# EAGLE design stm32f030f4p6-enc28j60 (EAGLE 7.2.0)
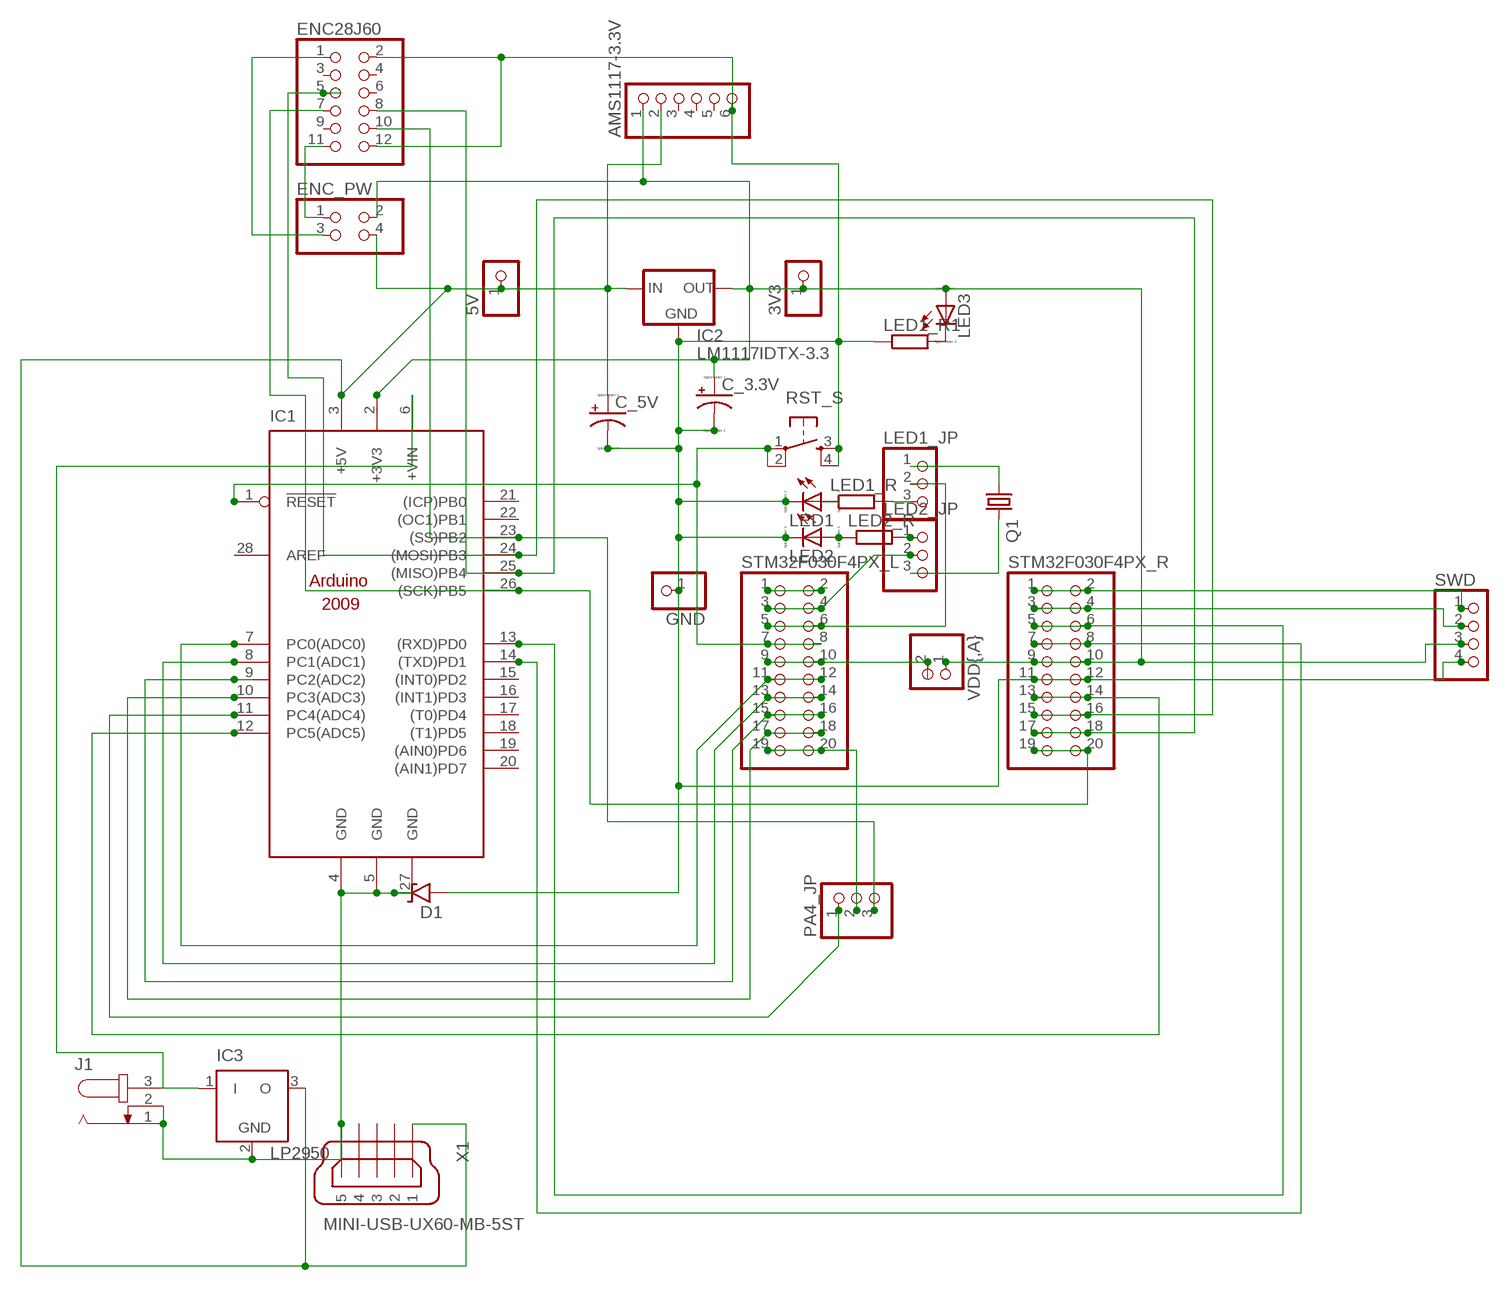
[diagram p0: schematic, sheet 1]

## Parts
3V3  PINHD-1X1_2.00  [1X01M]
5V  PINHD-1X1_2.00  [1X01M]
AMS1117-3.3V  PINHD-1X06_2.54  [1X06]
C_3.3V  CPOL-USE3.5-8  [E3,5-8]
C_5V  CPOL-USE3.5-8  [E3,5-8]
D1  1N9ZENER2  [DO35-2]
ENC28J60  PINHD-2X6_2.54  [2X06]
ENC_PW  PINHD-2X2_2.54  [2X02]
GND  PINHD-1X1_2.00  [1X01M]
IC1  ARDUINO2009_PIN_12  [ARDUINO2009_2]
IC2  LM1117IDTX-3.3  [TO252]
IC3  LP2950  [DPACK]
J1  JACK-PLUG0  [SPC4077]
LED1  LED_ELD260  [LED_LD260]
LED1_JP  PINHD-1X3_2.54  [1X03]
LED1_R  R-EU_0204/7  [0204/7]
LED1_R1  R-EU_0204/7  [0204/7]
LED2  LED_ELD260  [LED_LD260]
LED2_JP  PINHD-1X3_2.54  [1X03]
LED2_R  R-EU_0204/7  [0204/7]
LED3  LED_ELD260  [LED_LD260]
PA4_JP  PINHD-1X3_2.54  [1X03]
Q1  CRYSTALHC49S  [HC49/S]
RST_S  TAC_SWITCHPTH  [TACTILE-PTH]
STM32F030F4PX_L  PINHD-2X10  [2X10]
STM32F030F4PX_R  PINHD-2X10  [2X10]
SWD  PINHD-1X4  [1X04]
VDD{,A}  PINHD-1X2  [1X02]
X1  MINI-USB-UX60-MB-5ST  [UX60-MB-5ST]

## Nets
5V: 5V.1 AMS1117-3.3V.2 C_5V.+ ENC_PW.4 IC1.3(+5V) IC2.2(IN) IC3.3(O) X1.1
GND@0: AMS1117-3.3V.6 C_3.3V.- C_5V.- D1.A ENC28J60.2 ENC28J60.12 GND.1 IC2.1(GND) LED1.K(C) LED1_R1.1 LED2.K(C) RST_S.3 RST_S.4 STM32F030F4PX_R.11 STM32F030F4PX_R.12 SWD.4
GND_RAW: D1.C IC1.4(GND) IC1.5(GND) IC1.27(GND) IC3.2(GND) J1.1 J1.2 X1.5
N$1: STM32F030F4PX_L.9 STM32F030F4PX_L.10 VDD{,A}.2
N$3: STM32F030F4PX_L.1 STM32F030F4PX_L.2
N$4: LED2_JP.2 STM32F030F4PX_L.3 STM32F030F4PX_L.4
N$5: LED1_JP.2 STM32F030F4PX_L.5 STM32F030F4PX_L.6
N$6: PA4_JP.2 STM32F030F4PX_L.19 STM32F030F4PX_L.20
N$7: IC1.7(PC0(ADC0)) STM32F030F4PX_L.11 STM32F030F4PX_L.12
N$8: IC1.8(PC1(ADC1)) STM32F030F4PX_L.13 STM32F030F4PX_L.14
N$9: IC1.9(PC2(ADC2)) STM32F030F4PX_L.15 STM32F030F4PX_L.16
N$10: IC1.10(PC3(ADC3)) STM32F030F4PX_L.17 STM32F030F4PX_L.18
N$11: IC1.11(PC4(ADC4)) PA4_JP.1
N$12: ENC28J60.7 IC1.26((SCK)PB5) STM32F030F4PX_R.19 STM32F030F4PX_R.20
N$13: ENC28J60.8 IC1.25((MISO)PB4) STM32F030F4PX_R.17 STM32F030F4PX_R.18
N$14: LED1_JP.3 LED1_R.2
N$15: IC1.12(PC5(ADC5)) STM32F030F4PX_R.13 STM32F030F4PX_R.14
N$17: IC1.14((TXD)PD1) STM32F030F4PX_R.7 STM32F030F4PX_R.8
N$18: IC1.13((RXD)PD0) STM32F030F4PX_R.5 STM32F030F4PX_R.6
N$19: LED1_JP.1 Q1.1
N$20: LED2_JP.3 Q1.2
N$21: IC1.1(!RESET) RST_S.1 RST_S.2 STM32F030F4PX_L.7 STM32F030F4PX_L.8
N$23: ENC28J60.10 IC1.23((SS)PB2) PA4_JP.3
N$24: IC1.6(+VIN) IC3.1(I) J1.3
N$26: LED2.A LED2_R.1
N$27: LED1.A LED1_R.1
N$29: LED2_JP.1 LED2_R.2
N$187: ENC28J60.1 ENC_PW.3
N$188: ENC28J60.11 ENC_PW.1
N$190: ENC28J60.5 IC1.24((MOSI)PB3) STM32F030F4PX_R.15 STM32F030F4PX_R.16
N$242: LED1_R1.2 LED3.K(C)
SWD_CLK: STM32F030F4PX_R.1 STM32F030F4PX_R.2 SWD.1
SWD_IO: STM32F030F4PX_R.3 STM32F030F4PX_R.4 SWD.2
VDD: 3V3.1 AMS1117-3.3V.1 C_3.3V.+ ENC_PW.2 IC1.2(+3V3) IC2.TAB(OUT) LED3.A STM32F030F4PX_R.9 STM32F030F4PX_R.10 SWD.3 VDD{,A}.1
Unconnected: AMS1117-3.3V.3 AMS1117-3.3V.4 AMS1117-3.3V.5 ENC28J60.3 ENC28J60.4 ENC28J60.6 ENC28J60.9 IC1.15((INT0)PD2) IC1.16((INT1)PD3) IC1.17((T0)PD4) IC1.18((T1)PD5) IC1.19((AIN0)PD6) IC1.20((AIN1)PD7) IC1.21((ICP)PB0) IC1.22((OC1)PB1) IC1.28(AREF) X1.2 X1.3 X1.4

## Library data of the parts
3V3 5V GND = pinhead-1:PINHD-1X1: PIN HEADER
AMS1117-3.3V = pinhead-2:PINHD-1X06: PIN HEADER
C_3.3V C_5V = resistor:CPOL-US: POLARIZED CAPACITOR, American symbol
D1 = gm-diodes:1N9*ZENER: 1N9???B Zener Diode DO-35 case 1N957B - 1N992B (6.8V to 200V)
ENC28J60 = pinhead-1:PINHD-2X6: PIN HEADER
ENC_PW = pinhead-1:PINHD-2X2: PIN HEADER
IC1 = arduino:ARDUINO2009_PIN_1: The Arduino Duemilanove ("2009") is a microcontroller board based on the ATmega168 or ATmega328. - 14 digital input/output pins (of which 6 can be used as PWM outputs) - 6 analog inputs, a 16 MHz crystal oscillator - USB connection - power jack - ISP header - reset button It contains everything needed to support the microcontroller; simply connect it to a computer with a USB cable or power it with a AC-to-DC adapter or battery to get started http://arduino.cc/en/Main/ArduinoBoardDuemilanove
IC2 = lm1117:LM1117IDTX-*
IC3 = linear:LP2950: 100 mA, Low Power Low Dropout Voltage Regulator Source: http://www.onsemi.com/pub/Collateral/LP2950-D.PDF
J1 = tango:JACK-PLUG: DC POWER JACK Power Jack, DC, Right Angle, Through Hole, Rated 5A at 16VDC, PC Terminals Distributor: Farnell (www.Farnell.de) Drawing: 84N1161.pdf / 84N1162.pdf Manufacturer: SPC Technology (www.spctechnology.com) Type: SPC4077 / SPC 4078
LED1-LED3 = eagle-ltspice:LED_E: LED Source: http://www.osram.convergy.de Source: www.luxeon.com Source: www.kingbright.com; SPICEMODEL: NONE; SPICEPREFIX: D; SPICETYPE: diode
LED1_JP LED2_JP PA4_JP = pinhead-1:PINHD-1X3: PIN HEADER
LED1_R LED1_R1 LED2_R = resistor:R-EU_: RESISTOR, European symbol
Q1 = crystal:CRYSTAL: CRYSTAL; OC_FARNELL: 1667008; OC_NEWARK: unknown
RST_S = SparkFun:TAC_SWITCH: Momentary Switch Button commonly used for reset or general input. Spark Fun Electronics SKU : COM-00097
STM32F030F4PX_L STM32F030F4PX_R = pinhead:PINHD-2X10: PIN HEADER
SWD = pinhead:PINHD-1X4: PIN HEADER
VDD{,A} = pinhead:PINHD-1X2: PIN HEADER
X1 = con-hirose:MINI-USB-: MINI USB Connector Source: http://www.hirose.co.jp/cataloge_hp/e24000019.pdf; OC_FARNELL: unknown; OC_NEWARK: unknown

## Board
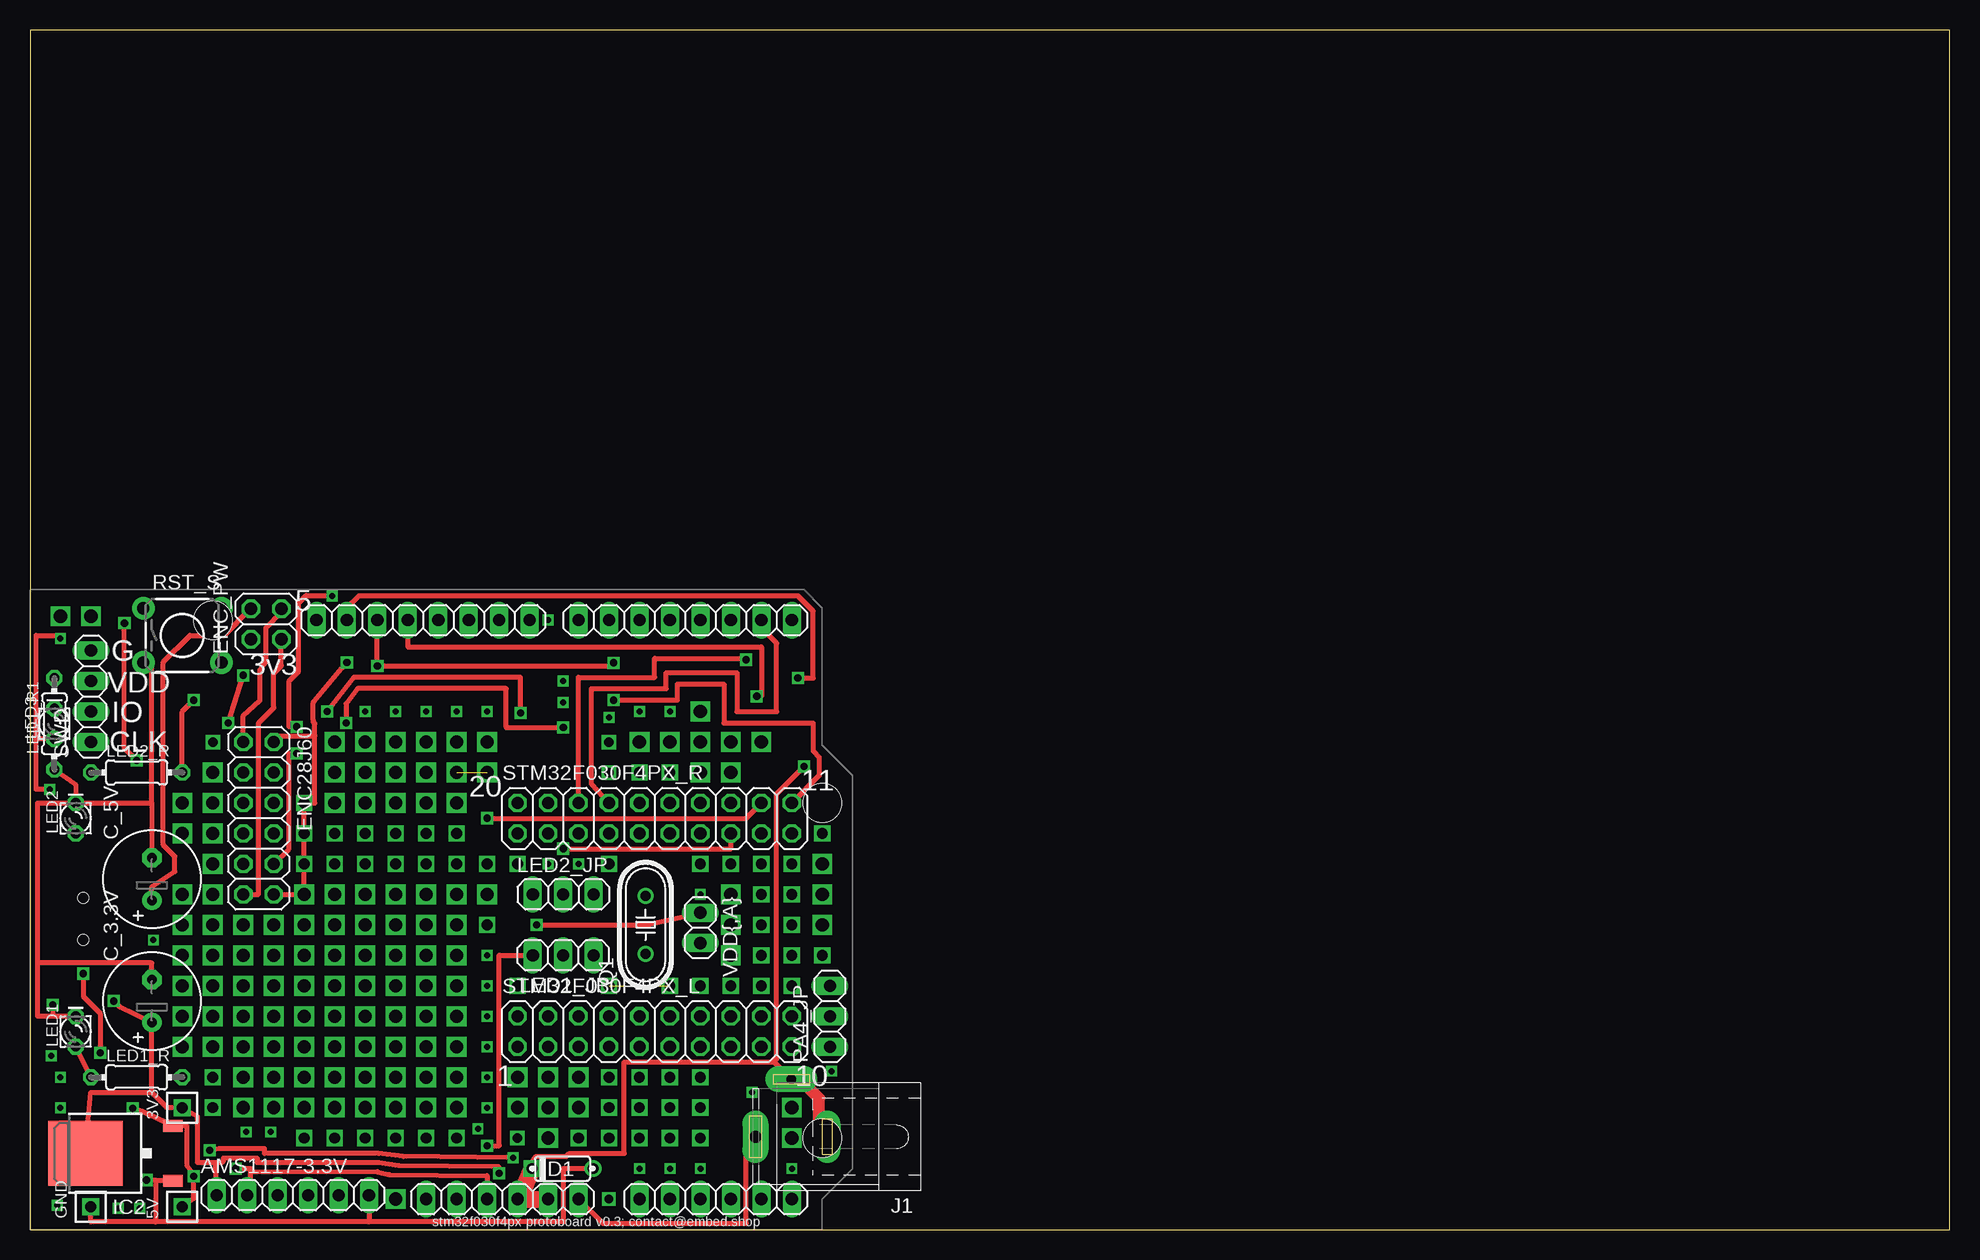
[diagram p1: board, top side]
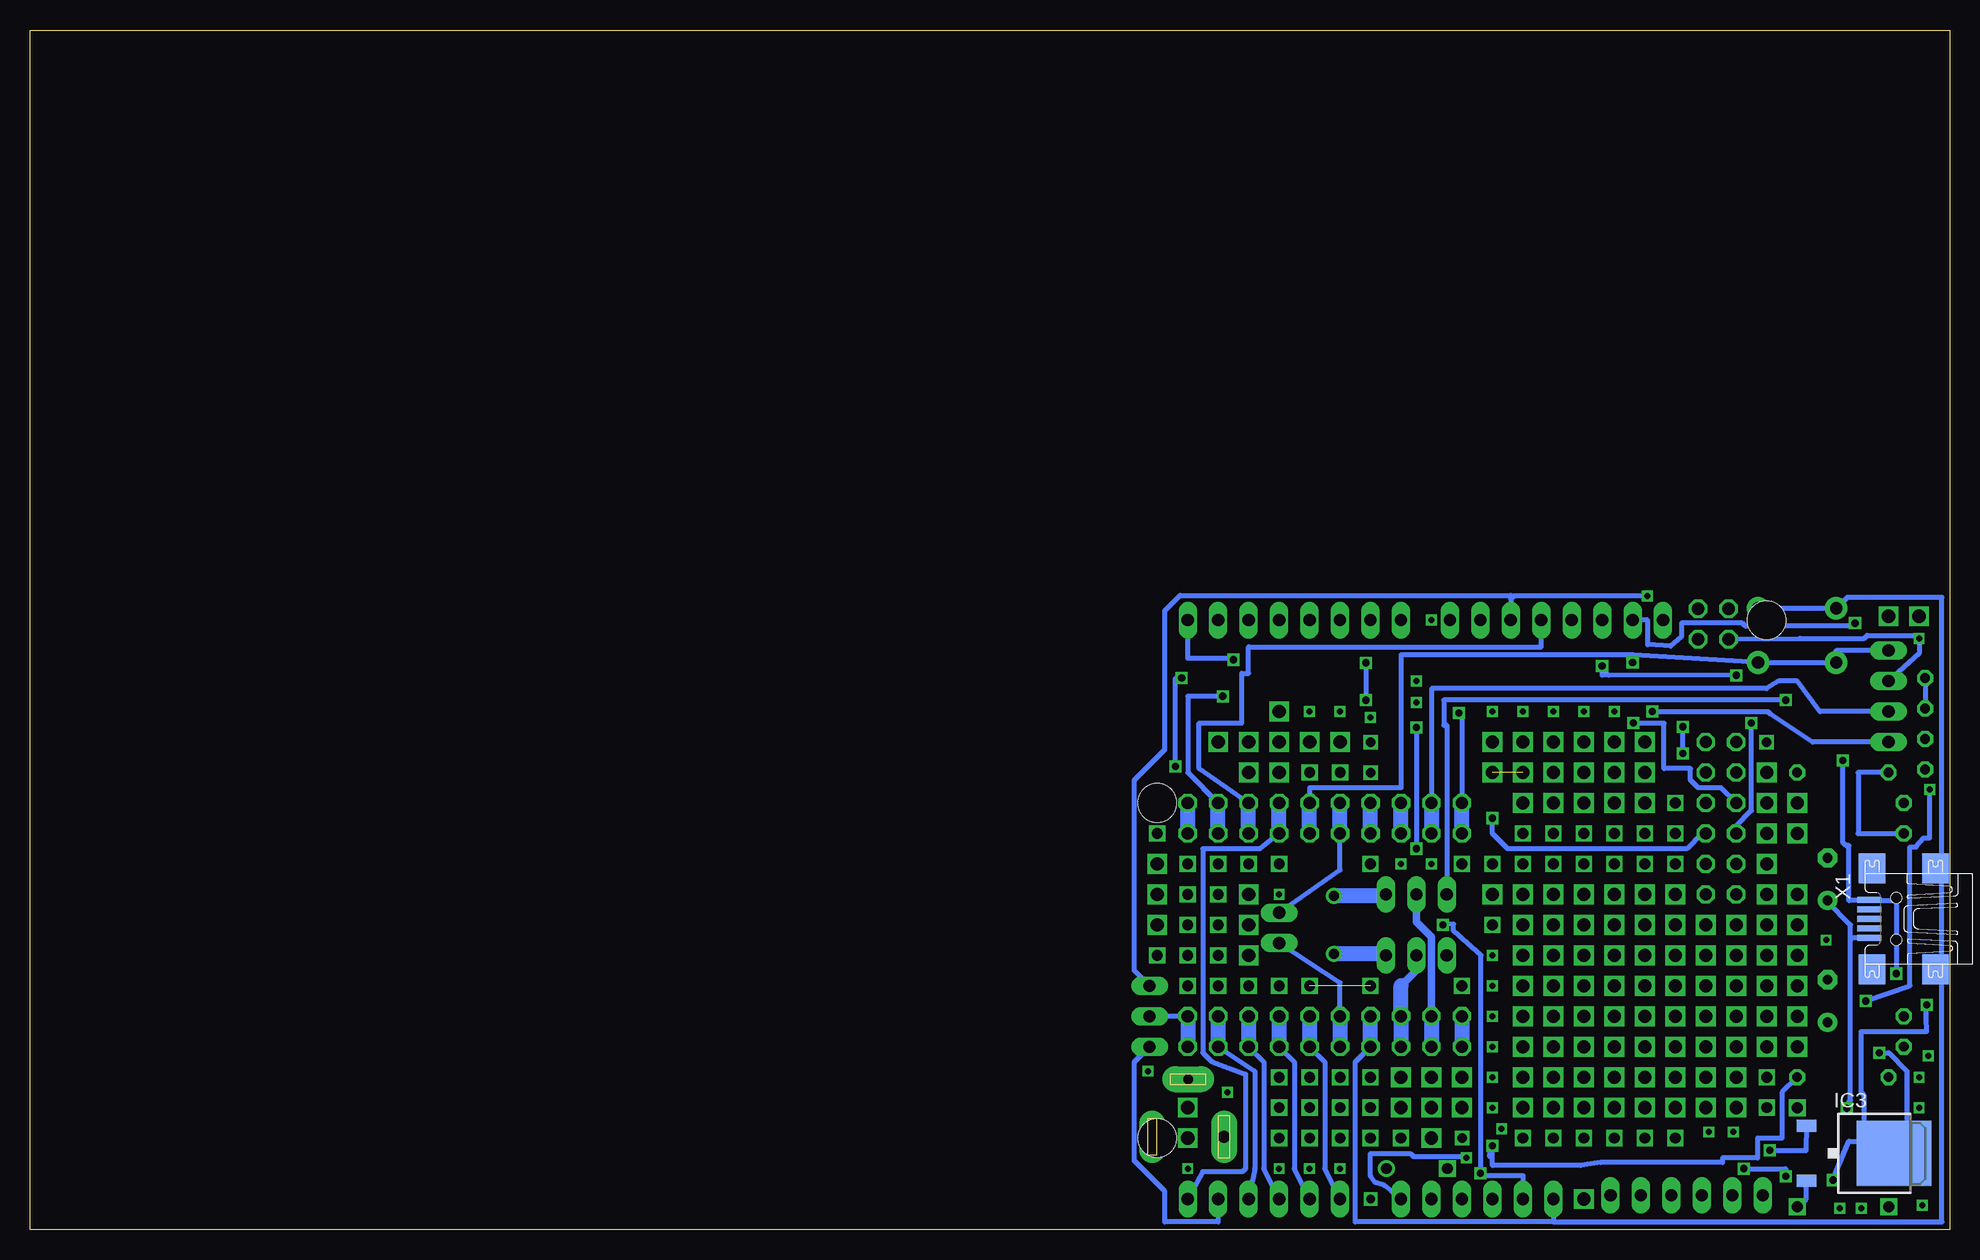
[diagram p2: board, bottom side, seen from below]

Size 160 x 100 mm. Coordinates in mm from the lower left corner, seen from the top.
Outline: 0,0 160,0 160,100 0,100 0,0
Copper layers (1*16): Top 0.035mm / dielectric 1.5mm / Bottom 0.035mm
Design rules "default": minimum track width 10mil, minimum drill 24mil, track to track 8mil, track to pad 8mil, pad to pad 8mil, via to via 8mil, smd to smd 8mil, copper to edge 40mil, drill to drill 8mil, minimum pad ring 10mil, minimum via ring 8mil, stop-mask expansion 4mil, vias tented up to drill 0mil, thermal gap 10mil

### Footprints (pad centres in the part's own frame; a part is rotated, then mirrored left to right if it is on the bottom)
1X01M = drill 0.914 square: 1 0,0
1X06 = drill 1.016 long: 1 -6.35,0; 2 -3.81,0; 3 -1.27,0; 4 1.27,0; 5 3.81,0; 6 6.35,0
E3,5-8 = drill 0.813 pad 1.6: + -1.778,0 | drill 0.813 pad 1.6 octagon: - 1.778,0
DO35-2 = drill 0.9: A 2.54,0 | drill 0.9 square: C -2.54,0
2X06 = drill 1.016 octagon: 1 -6.35,-1.27; 2 -6.35,1.27; 3 -3.81,-1.27; 4 -3.81,1.27; 5 -1.27,-1.27; 6 -1.27,1.27; 7 1.27,-1.27; 8 1.27,1.27; 9 3.81,-1.27; 10 3.81,1.27; 11 6.35,-1.27; 12 6.35,1.27
2X02 = drill 1.016 octagon: 1 -1.27,-1.27; 2 -1.27,1.27; 3 1.27,-1.27; 4 1.27,1.27
ARDUINO2009_2 = drill 1.016 long: 1 33.02,2.54; 2 35.56,2.54; 3 38.1,2.54; 4 40.64,2.54; 5 43.18,2.54; 6 45.72,2.54; 7 50.8,2.54; 8 53.34,2.54; 9 55.88,2.54; 10 58.42,2.54; 11 60.96,2.54; 12 63.5,2.54; 13 63.5,50.8; 14 60.96,50.8; 15 58.42,50.8; 16 55.88,50.8; 17 53.34,50.8; 18 50.8,50.8; 19 48.26,50.8; 20 45.72,50.8; 21 41.656,50.8; 22 39.116,50.8; 23 36.576,50.8; 24 34.036,50.8; 25 31.496,50.8; 26 28.956,50.8; 27 26.416,50.8; 28 23.876,50.8 | hole 3.2: 15.24,50.8; 66.04,35.56; 66.04,7.62
TO252 = smd 1 x 1.6: 1 -2.28,-4.8; 2 2.28,-4.8 | smd 5.4 x 6.2: TAB 0,2.5
DPACK = smd 1 x 1.6: 1 -2.28,-4.8; 3 2.28,-4.8 | smd 5.4 x 6.2: 2 0,2.5
SPC4077 = drill 0.8 pad 2.184 long: 1 -3,0; 2 0,-4.8 | drill 1 pad 2.184 long: 3 3,0
LED_LD260 = drill 0.813 octagon: A -1.27,0; K 1.27,0
1X03 = drill 1.016 long: 1 -2.54,0; 2 0,0; 3 2.54,0
0204/7 = drill 0.813 octagon: 1 -3.81,0; 2 3.81,0
HC49/S = drill 0.813: 1 -2.413,0; 2 2.413,0
TACTILE-PTH = drill 1.016 pad 1.88: 1 -3.251,2.261; 2 3.251,2.261; 3 -3.251,-2.261; 4 3.251,-2.261
2X10 = drill 1.016 octagon: 1 -11.43,-1.27; 2 -11.43,1.27; 3 -8.89,-1.27; 4 -8.89,1.27; 5 -6.35,-1.27; 6 -6.35,1.27; 7 -3.81,-1.27; 8 -3.81,1.27; 9 -1.27,-1.27; 10 -1.27,1.27; 11 1.27,-1.27; 12 1.27,1.27; 13 3.81,-1.27; 14 3.81,1.27; 15 6.35,-1.27; 16 6.35,1.27; 17 8.89,-1.27; 18 8.89,1.27; 19 11.43,-1.27; 20 11.43,1.27
1X04 = drill 1.016 long: 1 -3.81,0; 2 -1.27,0; 3 1.27,0; 4 3.81,0
1X02 = drill 1.016 long: 1 -1.27,0; 2 1.27,0
UX60-MB-5ST = smd 2 x 0.5: 1 2.25,1.6; 2 2.25,0.8; 3 2.25,0; 4 2.25,-0.8; 5 2.25,-1.6 | smd 2.2 x 2.5: M1 -3.3,-4.2; M2 -3.3,4.2; M3 2,4.2; M4 2,-4.2 | hole 0.9: 0,-1.75; 0,1.75

### Placement (x,y rotation side)
3V3  12.7,10.16 0 top
5V  12.7,1.91 0 top
AMS1117-3.3V  21.91,2.86 0 top
C_3.3V  10.16,19.05 90 top
C_5V  10.16,29.21 90 top
D1  44.39,5.08 0 top
ENC28J60  19.05,34.29 270 top
ENC_PW  19.68,50.48 90 top
GND  5.08,1.91 0 top
IC1  0,0 0 top
IC2  7.11,6.35 90 top
IC3  7.11,6.35 270 bottom
J1  63.46,7.72 180 top
LED1  3.81,16.51 90 top
LED1_JP  44.45,22.86 180 top
LED1_R  8.89,12.7 0 top
LED1_R1  2.03,42.16 90 top
LED2  3.81,34.29 90 top
LED2_JP  44.45,27.94 0 top
LED2_R  8.89,38.1 0 top
LED3  2.03,42.16 90 top
PA4_JP  66.67,17.78 90 top
Q1  51.31,25.4 90 top
RST_S  12.7,49.53 0 top
STM32F030F4PX_L  52.07,16.51 0 top
STM32F030F4PX_R  52.07,34.29 0 top
SWD  5.08,44.45 90 top
VDD{,A}  55.88,25.15 270 top
X1  4.46,25.9 180 bottom

### Tracks (layer width: path | path; a pad name or v marks a point on that pad's centre or on a via)
5V  (via drill 0.6)
  Top 0.406: 18.41,4.86 28.96,4.83 29.97,4.57 38.1,4.48 IC1.3 | 18.41,4.86 18.41,3.17 AMS1117-3.3V.2 | C_5V.+ 10.16,28.57 12.06,29.84 12.06,31.11 11.11,32.07 11.11,47.31 13.34,49.53 16.19,49.53 ENC_PW.4 | 5V.1 13.65,2.6 13.65,4.51 | 13.65,4.51 13.08,5.33 13.08,8.64 11.94,8.63 IC2.2 9.3,9.84 v8.57,10.1 | 18.41,4.86 18.41,5.08 v17.14,5.08 | v13.65,4.45 13.59,4.51 13.65,4.51
  Bottom 0.406: v17.14,5.08 13.65,5.08 v13.65,4.45 | v8.57,10.1 8.26,10.79 8.26,24.13 | 8.26,24.13 8.26,25.4 10.16,27.3 C_5V.+ | 5V.1 11.94,2.54 11.94,4.06 11.93,4.07 IC3.3 | X1.1 8.09,24.3 8.26,24.13
GND@0  (via drill 0.6)
  Top 0.406: LED1.K 1.91,17.78 | 1.91,17.78 0.64,17.78 0.64,22.23 | 0.64,22.23 0.64,35.56 LED2.K | LED2.K 10.16,35.56 | 10.16,35.56 C_5V.- | 10.16,35.56 10.16,47.27 RST_S.3 | C_3.3V.- 10.16,22.23 0.64,22.23 | ENC28J60.12 22.86,27.94 22.86,35.56 23.75,35.56 23.75,41.15 | ENC28J60.2 20.32,41.15 23.75,41.15 | 23.75,41.15 23.75,42.16 23.62,42.42 23.62,43.94 23.69,44.03 v26.42,47.27 | 10.48,0.64 10.48,4.03 IC2.1 10.48,4.11 v9.72,4.13 | 10.48,0.64 5.08,0.64 GND.1 | 28.26,0.64 44.45,0.64 44.45,5.08 D1.A | 28.26,0.64 10.48,0.64 | AMS1117-3.3V.6 28.26,0.64 | v1.91,18.73 1.91,17.78 | LED1_R1.1 3.81,37.08 LED2.K
  Bottom 0.406: SWD.4 9.45,48.26 RST_S.3 RST_S.4 26.36,47.9 | 26.36,47.9 26.42,47.9 45.72,47.9 45.72,36.83 53.34,36.83 STM32F030F4PX_R.12 | v9.72,4.13 8.38,7.37 7.11,7.37 7.11,11.18 7.37,11.43 7.37,16.51 1.91,16.51 1.97,18.73 v1.91,18.73 | v26.42,47.27 26.36,47.33 26.36,47.9
  Bottom 1.27: STM32F030F4PX_R.11 STM32F030F4PX_R.12
GND_RAW  (via drill 0.6)
  Top 0.406: J1.2 62.01,13.97 61.98,13.97 | 41.4,5.08 42.16,6.1 44.7,6.1 44.96,6.35 49.53,6.35 49.53,13.97 61.98,13.97 | 41.4,5.08 D1.C | v8.89,39.12 7.87,40.13 v7.87,50.55 | 61.98,13.97 62.23,14.22 62.23,36.32 v64.52,38.61 | v64.01,45.97 65.28,45.97 65.28,51.56 64.01,52.83 27.43,52.83 26.42,51.82 IC1.27 | v4.45,21.34 4.45,19.43 5.84,18.03 v5.84,14.73 | IC1.4 41.4,5.08
  Top 1.016: J1.1 65.79,8.4 65.79,10.92 64.19,12.52 J1.2
  Top 1.422: IC1.5 IC1.4 40.96,2.86 D1.C
  Bottom 0.406: X1.5 6.71,27.43 | 6.71,27.43 8.38,27.43 8.38,32 8.64,32 8.89,32.26 v8.89,39.12 | v7.87,50.55 8.13,50.29 17.02,50.29 17.27,50.55 22.35,50.55 22.35,49.4 23.24,48.64 25.15,48.77 25.15,50.8 IC1.27 | v64.52,38.61 64.52,45.97 v64.01,45.97 | 6.71,27.43 4.45,27.43 v4.45,21.34 | v5.84,14.73 5.08,14.73 3.56,13.21 3.56,7.41 IC3.2
N$1
  Bottom 0.406: STM32F030F4PX_L.10 50.8,18.03 50.8,20.57 VDD{,A}.2
  Bottom 1.27: STM32F030F4PX_L.10 STM32F030F4PX_L.9
N$2  (via drill 1.1)
  other vias: 17.78,10.16
N$3
  Bottom 1.27: STM32F030F4PX_L.2 STM32F030F4PX_L.1
N$4
  Bottom 0.61: STM32F030F4PX_L.4 43.18,24.38 44.45,25.65 LED2_JP.2
  Bottom 1.27: STM32F030F4PX_L.4 STM32F030F4PX_L.3
N$5
  Bottom 0.61: 45.72,20.32 44.45,21.59 LED1_JP.2
  Bottom 1.27: STM32F030F4PX_L.5 STM32F030F4PX_L.6 45.72,20.32
N$6
  Bottom 0.406: STM32F030F4PX_L.20 PA4_JP.2
  Bottom 1.27: STM32F030F4PX_L.20 STM32F030F4PX_L.19
N$7
  Bottom 0.406: STM32F030F4PX_L.11 52.07,13.97 52.07,5.08 IC1.7
  Bottom 1.27: STM32F030F4PX_L.12 STM32F030F4PX_L.11
N$8
  Bottom 0.406: STM32F030F4PX_L.13 54.61,13.97 54.61,5.08 IC1.8
  Bottom 1.27: STM32F030F4PX_L.14 STM32F030F4PX_L.13
N$9
  Bottom 0.406: STM32F030F4PX_L.15 57.15,13.97 57.15,5.08 IC1.9
  Bottom 1.27: STM32F030F4PX_L.16 STM32F030F4PX_L.15
N$10
  Bottom 0.406: STM32F030F4PX_L.17 57.91,13.21 57.91,5.08 IC1.10
  Bottom 1.27: STM32F030F4PX_L.18 STM32F030F4PX_L.17
N$11
  Bottom 0.406: IC1.11 60.96,0.64 65.41,0.64 65.41,3.17 67.94,5.71 67.94,13.97 PA4_JP.1
N$12  (via drill 0.6)
  Top 0.406: v48.65,47.24 48.64,47.37 48.64,46.99 29.53,46.99 28.96,47.24 v28.96,46.99 IC1.26 | v48.65,44.13 53.98,44.13 53.98,45.47 57.85,45.47 57.85,42.23 65.28,42.23 65.28,39.88 65.79,39.37 65.79,37.85 STM32F030F4PX_R.20 | v16.51,42.23 v17.78,46.2
  Bottom 0.406: v48.65,47.24 v48.65,44.13 | ENC28J60.7 17.78,33.66 16.51,34.92 v16.51,42.23 | v17.78,46.2 28.4,46.23 28.96,46.23 v28.96,46.99
  Bottom 1.27: STM32F030F4PX_R.19 STM32F030F4PX_R.20
N$13  (via drill 0.6)
  Top 0.406: IC1.25 31.5,48.58 60.96,48.58 60.96,44.45 v60.58,44.45 | v38.1,34.29 59.69,34.29 STM32F030F4PX_R.18
  Bottom 0.406: v60.58,44.45 63.5,44.45 63.5,38.1 STM32F030F4PX_R.18 | ENC28J60.8 20.64,33.02 21.91,31.75 36.83,31.75 38.1,33.02 v38.1,34.29
  Bottom 1.27: STM32F030F4PX_R.17 STM32F030F4PX_R.18
N$14  (via drill 0.6)
  Top 0.406: v38.1,6.99 39.12,6.99 39.12,22.86 LED1_JP.3
  Bottom 0.406: LED1_R.2 13.97,11.43 13.97,7.62 16,7.62 16,5.97 18.92,5.97 18.92,5.59 29.08,5.59 30.73,5.33 38.1,5.33 v38.1,6.99 38.35,6.1
N$15
  Bottom 0.406: STM32F030F4PX_R.13 57.47,31.75 62.23,31.75 62.23,14.73 61.47,13.97 58.67,12.95 58.67,5.08 58.93,4.83 62.23,4.83 IC1.12
  Bottom 1.27: STM32F030F4PX_R.13 STM32F030F4PX_R.14
N$16  (via drill 1.1)
  other vias: 20.32,10.16
N$17
  Top 0.406: STM32F030F4PX_R.8 46.8,37.15 46.8,45.09 53.02,45.09 53.02,46.42 58.93,46.42 58.93,43.18 62.23,43.18 62.23,48.9 60.96,50.16 IC1.14
  Bottom 1.27: STM32F030F4PX_R.7 STM32F030F4PX_R.8
N$18  (via drill 0.6)
  Top 0.406: STM32F030F4PX_R.6 45.72,46.04 52.07,46.04 52.07,47.62 59.69,47.62 v59.69,47.5
  Bottom 0.406: v59.69,47.5 59.69,47.62 63.5,47.62 IC1.13
  Bottom 1.27: STM32F030F4PX_R.5 STM32F030F4PX_R.6
N$19
  Bottom 1.27: LED1_JP.1 47.12,22.99 Q1.1
N$20
  Bottom 1.27: LED2_JP.3 47.12,27.81 Q1.2
N$21
  Bottom 0.406: 33.02,0.64 0.64,0.64 0.64,52.7 8.53,52.7 RST_S.1 RST_S.2 | IC1.1 33.02,0.64 | 33.02,0.64 49.53,0.64 49.53,13.97 STM32F030F4PX_L.7
  Bottom 1.27: STM32F030F4PX_L.7 STM32F030F4PX_L.8
N$22  (via drill 0.7)
  other vias: 48.26,2.54
N$23  (via drill 0.5, 0.6)
  Top 0.406: ENC28J60.10 21.59,31.75 21.59,39.69 v22.23,39.69 | v22.23,41.91 21.59,41.91 21.59,45.72 22.39,46.52 22.39,52.23 23.02,52.87 25.18,52.87 v25.2,52.81
  Bottom 0.406: PA4_JP.3 67.94,21.59 67.94,37.47 65.41,40.01 65.41,51.6 64.14,52.87 36.58,52.87 36.58,52.58 | 36.58,52.58 IC1.23 | v22.23,39.69 v22.23,41.91 | v25.2,52.81 36.32,52.83 36.58,52.58
N$24  (via drill 0.5, 0.6)
  Top 0.406: IC1.6 47.75,0.51 59.69,0.51 59.69,6.1 60.46,6.87 J1.3 | v40.26,5.97 31.11,6.1 29.08,6.35 19.56,6.35 19.56,6.73 15.75,6.73 v14.99,6.6
  Bottom 0.406: IC1.6 46.48,3.17 47.12,3.68 47.88,3.94 48.26,4.45 48.26,6.35 44.96,6.35 44.7,6.1 40.26,6.1 v40.26,5.97 | v14.99,6.6 11.94,6.6 IC3.1
N$26
  Bottom 0.406: LED2_R.1 7.62,38.1 7.62,33.02 LED2.A
N$27
  Top 0.406: LED1_R.1 LED1.A
N$28  (via drill 0.9)
  other vias: 48.26,7.62
N$29  (via drill 0.6)
  Top 0.406: LED2_R.2 12.7,43.18 v13.65,44.13
  Bottom 0.406: v13.65,44.13 42.16,44.13 42.16,42.04 41.91,42.04 LED2_JP.1
N$30  (via drill 1.1)
  other vias: 22.86,10.16
N$31  (via drill 1.1)
  other vias: 25.4,10.16
N$32  (via drill 1.1)
  other vias: 27.94,10.16
N$33  (via drill 1.1)
  other vias: 30.48,10.16
N$34  (via drill 1.1)
  other vias: 33.02,10.16
N$35  (via drill 1.1)
  other vias: 35.56,10.16
N$36  (via drill 1.1)
  other vias: 35.56,12.7
N$37  (via drill 1.1)
  other vias: 35.56,15.24
N$38  (via drill 1.1)
  other vias: 35.56,17.78
N$39  (via drill 1.1)
  other vias: 35.56,20.32
N$40  (via drill 1.1)
  other vias: 35.56,22.86
N$41  (via drill 1.1)
  other vias: 35.56,25.4
N$42  (via drill 1.1)
  other vias: 35.56,27.94
N$43  (via drill 0.9)
  other vias: 66.04,35.56
N$44  (via drill 0.9)
  other vias: 35.56,33.02
N$45  (via drill 1.1)
  other vias: 35.56,35.56
N$46  (via drill 1.1)  (1 unrouted)
  other vias: 35.56,38.1 38.1,38.1
N$47  (via drill 1.1)
  other vias: 35.56,40.64
N$48  (via drill 1.1)
  other vias: 33.02,40.64
N$49  (via drill 1.1)
  other vias: 33.02,38.1
N$50  (via drill 1.1)
  other vias: 33.02,35.56
N$51  (via drill 0.9)
  other vias: 33.02,33.02
N$52  (via drill 0.9)
  other vias: 33.02,30.48
N$53  (via drill 1.1)
  other vias: 33.02,27.94
N$54  (via drill 1.1)
  other vias: 33.02,25.4
N$55  (via drill 1.1)
  other vias: 33.02,22.86
N$56  (via drill 1.1)
  other vias: 33.02,20.32
N$57  (via drill 1.1)
  other vias: 33.02,17.78
N$58  (via drill 1.1)
  other vias: 33.02,15.24
N$59  (via drill 1.1)
  other vias: 33.02,12.7
N$60  (via drill 1.1)
  other vias: 30.48,12.7
N$61  (via drill 1.1)
  other vias: 30.48,15.24
N$62  (via drill 1.1)
  other vias: 30.48,20.32
N$63  (via drill 1.1)
  other vias: 30.48,22.86
N$64  (via drill 1.1)
  other vias: 30.48,25.4
N$65  (via drill 1.1)
  other vias: 30.48,27.94
N$66  (via drill 0.9)
  other vias: 30.48,33.02
N$67  (via drill 1.1)
  other vias: 30.48,35.56
N$68  (via drill 0.9)
  other vias: 30.48,30.48
N$69  (via drill 1.1)
  other vias: 30.48,17.78
N$70  (via drill 1.1)
  other vias: 27.94,12.7
N$71  (via drill 1.1)
  other vias: 22.86,12.7
N$72  (via drill 1.1)
  other vias: 25.4,12.7
N$73  (via drill 1.1)
  other vias: 20.32,12.7
N$74  (via drill 1.1)
  other vias: 17.78,12.7
N$75  (via drill 1.1)
  other vias: 17.78,15.24
N$76  (via drill 1.1)
  other vias: 17.78,17.78
N$77  (via drill 1.1)
  other vias: 17.78,20.32
N$78  (via drill 1.1)
  other vias: 17.78,22.86
N$79  (via drill 1.1)
  other vias: 17.78,25.4
N$80  (via drill 0.9)
  other vias: 50.8,7.62
N$81  (via drill 0.9)
  other vias: 53.34,7.62
N$82  (via drill 0.9)
  other vias: 55.88,7.62
N$83  (via drill 0.9)
  other vias: 55.88,10.16
N$84  (via drill 0.9)
  other vias: 50.8,12.7
N$85  (via drill 0.9)
  other vias: 55.88,12.7
N$86  (via drill 0.9)
  other vias: 48.26,10.16
N$87  (via drill 0.9)
  other vias: 50.8,10.16
N$88  (via drill 1.1)
  other vias: 25.4,40.64
N$89  (via drill 1.1)
  other vias: 27.94,40.64
N$90  (via drill 1.1)
  other vias: 30.48,40.64
N$91  (via drill 1.1)
  other vias: 30.48,38.1
N$92  (via drill 1.1)
  other vias: 27.94,38.1
N$93  (via drill 1.1)
  other vias: 25.4,38.1
N$94  (via drill 0.9)
  other vias: 53.34,10.16
N$95  (via drill 0.9)
  other vias: 53.34,12.7
N$96  (via drill 0.9)
  other vias: 48.26,12.7
N$97  (via drill 0.9)
  other vias: 22.86,35.56
N$98  (via drill 1.1)
  other vias: 25.4,35.56
N$99  (via drill 1.1)
  other vias: 27.94,35.56
N$100  (via drill 0.9)
  other vias: 27.94,33.02
N$101  (via drill 0.9)
  other vias: 25.4,33.02
N$102  (via drill 0.9)
  other vias: 22.86,33.02
N$103  (via drill 1.1)
  other vias: 45.72,10.16
N$104  (via drill 1.1)
  other vias: 43.18,10.16
N$105  (via drill 0.9)
  other vias: 22.86,30.48
N$106  (via drill 0.9)
  other vias: 25.4,30.48
N$107  (via drill 0.9)
  other vias: 27.94,30.48
N$108  (via drill 1.1)
  other vias: 27.94,27.94
N$109  (via drill 1.1)
  other vias: 25.4,27.94
N$110  (via drill 1.1)
  other vias: 22.86,27.94
N$111  (via drill 1.1)
  other vias: 27.94,25.4
N$112  (via drill 1.1)
  other vias: 27.94,22.86
N$113  (via drill 1.1)
  other vias: 27.94,20.32
N$114  (via drill 1.1)
  other vias: 27.94,17.78
N$115  (via drill 1.1)
  other vias: 27.94,15.24
N$116  (via drill 1.1)
  other vias: 25.4,15.24
N$117  (via drill 1.1)
  other vias: 25.4,20.32
N$118  (via drill 1.1)
  other vias: 25.4,22.86
N$119  (via drill 1.1)
  other vias: 25.4,25.4
N$120  (via drill 1.1)
  other vias: 25.4,17.78
N$121  (via drill 1.1)
  other vias: 22.86,17.78
N$122  (via drill 1.1)
  other vias: 22.86,15.24
N$123  (via drill 1.1)
  other vias: 20.32,15.24
N$124  (via drill 1.1)
  other vias: 20.32,17.78
N$125  (via drill 1.1)
  other vias: 20.32,20.32
N$126  (via drill 1.1)
  other vias: 20.32,22.86
N$127  (via drill 1.1)
  other vias: 20.32,25.4
N$128  (via drill 1.1)
  other vias: 40.64,10.16
N$129  (via drill 1.1)
  other vias: 22.86,22.86
N$130  (via drill 1.1)
  other vias: 22.86,20.32
N$131  (via drill 1.1)
  other vias: 22.86,25.4
N$132  (via drill 0.8)
  other vias: 15.24,40.64
N$133  (via drill 1.1)
  other vias: 15.24,38.1
N$134  (via drill 1.1)
  other vias: 15.24,35.56
N$135  (via drill 1.1)
  other vias: 15.24,15.24
N$136  (via drill 1.1)
  other vias: 15.24,33.02
N$137  (via drill 1.1)
  other vias: 15.24,25.4
N$138  (via drill 1.1)
  other vias: 15.24,22.86
N$139  (via drill 1.1)
  other vias: 15.24,17.78
N$140  (via drill 1.1)
  other vias: 15.24,30.48
N$141  (via drill 1.1)
  other vias: 15.24,27.94
N$142  (via drill 1.1)
  other vias: 15.24,20.32
N$143  (via drill 1.1)
  other vias: 38.1,27.94
N$144  (via drill 0.9)  (1 unrouted)
  other vias: 53.34,20.32 48.26,20.32
N$145  (via drill 1.1)
  other vias: 58.42,22.86
N$146  (via drill 1.1)
  other vias: 58.42,25.4
N$147  (via drill 0.9)
  other vias: 60.96,20.32
N$148  (via drill 0.9)
  other vias: 60.96,22.86
N$149  (via drill 1.1)
  other vias: 58.42,27.94
N$150  (via drill 1.1)
  other vias: 66.04,25.4
N$151  (via drill 1.1)
  other vias: 66.04,27.94
N$152  (via drill 1.1)
  other vias: 66.04,30.48
N$153  (via drill 0.9)
  other vias: 60.96,25.4
N$154  (via drill 0.9)
  other vias: 60.96,27.94
N$155  (via drill 0.9)
  other vias: 66.04,22.86
N$156  (via drill 1.1)
  other vias: 2.54,51.12
N$157  (via drill 1.1)
  other vias: 5.08,51.12
N$158  (via drill 0.9)
  other vias: 63.5,27.94
N$159  (via drill 0.9)
  other vias: 63.5,25.4
N$160  (via drill 0.9)
  other vias: 63.5,20.32
N$161  (via drill 1.1)
  other vias: 12.7,15.24
N$162  (via drill 1.1)
  other vias: 12.7,35.56
N$163  (via drill 1.1)
  other vias: 12.7,25.4
N$164  (via drill 1.1)
  other vias: 12.7,33.02
N$165  (via drill 1.1)
  other vias: 12.7,17.78
N$166  (via drill 1.1)
  other vias: 12.7,20.32
N$167  (via drill 1.1)
  other vias: 12.7,22.86
N$168  (via drill 1.1)
  other vias: 12.7,27.94
N$169  (via drill 0.9)
  other vias: 63.5,22.86
N$170  (via drill 0.9)
  other vias: 63.5,30.48
N$171  (via drill 0.9)
  other vias: 66.04,33.02
N$172  (via drill 0.8)
  other vias: 40.64,7.62
N$173  (via drill 1.1)
  other vias: 43.18,7.62
N$174  (via drill 0.9)
  other vias: 45.72,7.62
N$175  (via drill 1.1)
  other vias: 45.72,12.7
N$176  (via drill 1.1)
  other vias: 43.18,12.7
N$177  (via drill 1.1)
  other vias: 40.64,12.7
N$178  (via drill 0.9)
  other vias: 38.1,30.48
N$179  (via drill 0.9)
  other vias: 58.42,20.32
N$180  (via drill 0.9)
  other vias: 55.88,20.32
N$181  (via drill 0.9)
  other vias: 40.64,30.48
N$182  (via drill 0.9)
  other vias: 35.56,30.48
N$183  (via drill 0.9)
  other vias: 15.24,12.7
N$184  (via drill 0.9)
  other vias: 15.24,10.16
N$185  (via drill 0.9)
  other vias: 22.86,7.62
N$186  (via drill 0.9)
  other vias: 25.4,7.62
N$187
  Top 0.406: ENC28J60.1 17.78,42.86 19.18,44.13 19.18,46.67 19.68,47.31 19.68,50.16 20.95,51.44 ENC_PW.3
N$188
  Top 0.406: ENC28J60.11 19.05,27.94 19.05,42.23 20.32,43.5 20.32,46.35 20.95,46.99 ENC_PW.1
N$189  (via drill 0.9)
  other vias: 27.94,7.62
N$190  (via drill 0.6)
  Top 0.406: v44.45,41.85 39.69,41.85 39.69,45.09 27.3,45.09 26.35,43.81 v26.35,42.23 | v44.45,31.75 58.42,31.75 STM32F030F4PX_R.15
  Bottom 0.406: STM32F030F4PX_R.16 62.55,38.42 62.55,42.23 58.99,42.23 58.99,46.35 58.42,46.35 58.42,48.58 34.04,48.58 IC1.24 | ENC28J60.5 19.05,36.83 20.95,36.83 21.59,37.47 21.59,38.42 23.81,38.42 23.81,42.23 v26.35,42.23 | v44.45,41.85 v44.45,31.75
  Bottom 1.27: STM32F030F4PX_R.15 STM32F030F4PX_R.16
N$191  (via drill 0.9)
  other vias: 30.48,7.62
N$192  (via drill 0.9)
  other vias: 33.02,7.62
N$193  (via drill 0.9)
  other vias: 35.56,7.62
N$194  (via drill 0.9)
  other vias: 38.1,25.4
N$195  (via drill 0.5)
  other vias: 38.1,22.86
N$196  (via drill 0.5)
  other vias: 38.1,20.32
N$197  (via drill 0.5)
  other vias: 38.1,17.78
N$198  (via drill 0.5)
  other vias: 38.1,15.24
N$199  (via drill 0.5)
  other vias: 38.1,12.7
N$200  (via drill 0.5)
  other vias: 38.1,10.16
N$201  (via drill 0.5)
  other vias: 20.07,8.13
N$202  (via drill 0.5)
  other vias: 18.03,8.13
N$203  (via drill 0.5)
  other vias: 2.29,2.03
N$204  (via drill 0.5)
  other vias: 27.94,43.18
N$205  (via drill 0.5)
  other vias: 30.48,43.18
N$206  (via drill 0.5)
  other vias: 33.02,43.18
N$207  (via drill 0.5)
  other vias: 35.56,43.18
N$208  (via drill 0.5)
  other vias: 38.1,43.18
N$209  (via drill 1.1)
  other vias: 38.1,40.64
N$210  (via drill 1.1)
  other vias: 63.5,7.62
N$211  (via drill 1.1)
  other vias: 63.5,10.16
N$212  (via drill 0.9)
  other vias: 60.96,30.48
N$213  (via drill 0.9)
  other vias: 58.42,30.48
N$214  (via drill 0.9)
  other vias: 55.88,30.48
N$215  (via drill 0.5)
  other vias: 55.88,27.94
N$216  (via drill 1.1)
  other vias: 58.42,38.1
N$217  (via drill 1.1)
  other vias: 58.42,40.64
N$218  (via drill 1.1)
  other vias: 55.88,43.18
N$219  (via drill 1.1)
  other vias: 55.88,40.64
N$220  (via drill 1.1)
  other vias: 53.34,40.64
N$221  (via drill 1.1)
  other vias: 50.8,40.64
N$222  (via drill 0.8)
  other vias: 48.26,40.64
N$223  (via drill 1.1)
  other vias: 60.96,40.64
N$224  (via drill 1.1)
  other vias: 55.88,38.1
N$225  (via drill 0.9)
  other vias: 53.34,38.1
N$226  (via drill 0.9)
  other vias: 50.8,38.1
N$227  (via drill 0.8)
  other vias: 48.26,38.1
N$228  (via drill 0.5)
  other vias: 53.34,43.18
N$229  (via drill 0.5)
  other vias: 50.8,43.18
N$230  (via drill 0.5)
  other vias: 43.18,50.8
N$231  (via drill 1.1)
  other vias: 30.48,2.54
N$232  (via drill 0.5)
  other vias: 53.34,5.08
N$233  (via drill 0.5)
  other vias: 10.29,24.13
N$234  (via drill 0.5)
  other vias: 50.8,5.08
N$235  (via drill 0.5)
  other vias: 63.5,5.08
N$236  (via drill 0.5)
  other vias: 2.54,12.7
N$237  (via drill 0.5)
  other vias: 2.54,10.16
N$238  (via drill 0.9)
  other vias: 40.64,20.32
N$239  (via drill 0.9)
  other vias: 48.26,30.48
N$240  (via drill 0.5)
  other vias: 45.72,30.48
N$241  (via drill 0.5)
  other vias: 43.18,30.48
N$242
  Bottom 0.406: LED1_R1.2 LED3.K
N$243  (via drill 0.5)
  other vias: 37.34,8.38
N$244  (via drill 0.5)
  other vias: 55.88,5.08
N$245  (via drill 0.5)
  other vias: 66.8,13.21
N$246  (via drill 0.5)
  other vias: 60.2,11.43
N$247  (via drill 0.5)
  other vias: 48.26,42.67
N$248  (via drill 0.5)
  other vias: 44.45,43.94
N$249  (via drill 0.5)
  other vias: 44.45,45.72
N$250  (via drill 0.5)
  other vias: 9.14,1.78
N$251  (via drill 0.5)
  other vias: 1.78,14.48
N$252  (via drill 0.5)
  other vias: 7.37,1.78
SWD_CLK  (via drill 0.6)
  Top 0.406: v40.89,43.05 40.89,46.04 26.99,46.04 v24.77,43.18
  Bottom 0.406: SWD.1 11.43,40.64 14.95,42.98 | 14.95,42.98 15.24,43.18 | v40.89,43.05 40.64,43.05 STM32F030F4PX_R.2 | v24.77,43.18 15.14,43.18 14.95,42.98
  Bottom 1.27: STM32F030F4PX_R.1 STM32F030F4PX_R.2
SWD_IO
  Bottom 0.406: SWD.2 10.79,43.18 12.7,45.72 14.29,45.72 15.25,45.09 43.18,45.09 STM32F030F4PX_R.4
  Bottom 1.27: STM32F030F4PX_R.4 STM32F030F4PX_R.3
VDD  (via drill 0.5, 0.6)
  Top 0.406: 10.16,11.43 11.43,10.16 3V3.1 13.97,9.4 13.97,5.59 15.49,5.59 | 10.16,11.43 C_3.3V.+ 7.49,18.54 v6.99,19.05 | IC2.TAB 5.08,11.43 10.16,11.43 | AMS1117-3.3V.1 15.49,5.59 | 15.49,5.59 16,5.59 16.13,5.71 16.13,5.97 18.92,5.97 18.92,5.59 29.08,5.59 30.73,5.33 39.05,5.27 v39.12,4.7 | v42.23,25.4 51.31,25.4 VDD{,A}.1 | v1.65,36.7 0.51,36.7 0.51,40.89 | 0.51,40.89 0.51,49.53 2.54,49.53 v2.54,49.28 | LED3.A 0.51,40.89
  Bottom 0.406: VDD{,A}.1 50.8,29.97 STM32F030F4PX_R.9 | v6.99,19.05 3.3,20.32 3.3,31.88 2.79,31.88 2.16,32.64 1.65,32.64 v1.65,36.7 | SWD.3 2.54,48.01 v2.54,49.28 2.54,49.53 6.86,49.53 7.11,49.28 12.45,49.28 ENC_PW.2 | v39.12,4.7 39.05,4.51 | 39.05,4.51 35.56,4.51 IC1.2 | 39.05,4.51 39.05,22.86 41.34,24.89 41.34,25.46 42.55,25.4 v42.23,25.4
  Bottom 1.27: STM32F030F4PX_R.9 STM32F030F4PX_R.10

### Text on the board
tNames: 5 | G | 3v3 | VDD | IO | CLK | 11 | 20 | 1 | 10 | stm32f030f4px protoboard v0.3; contact@embed.shop